# Altium schematic sheet Main_Board.SchDoc
size A0; Organization: Altium Limited; Address1: L3, 12a Rodborough Rd; Address2: Frenchs Forest; Address3: NSW; Address4: Australia 2086
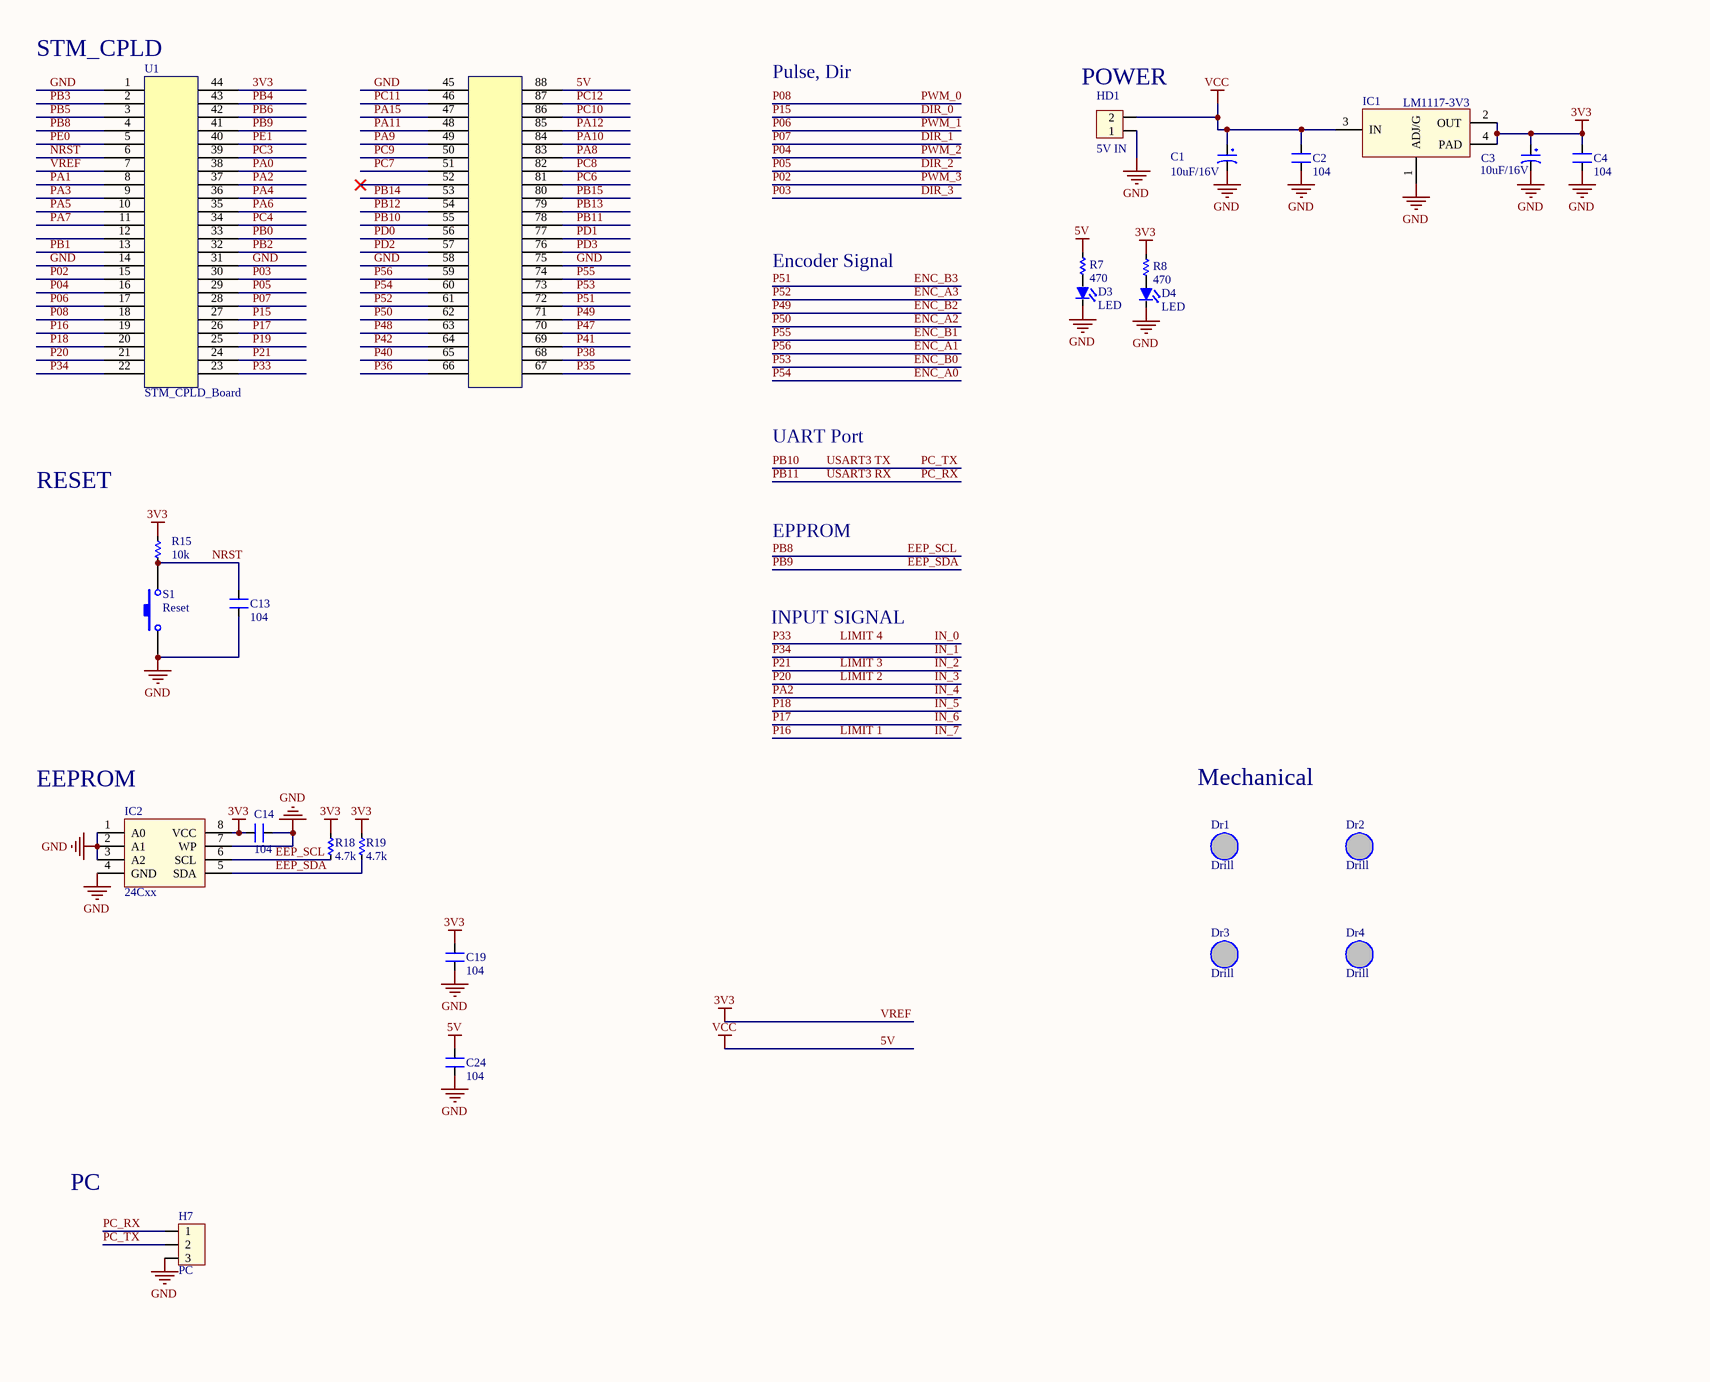
[diagram p0: Main_Board.SchDoc, top left]
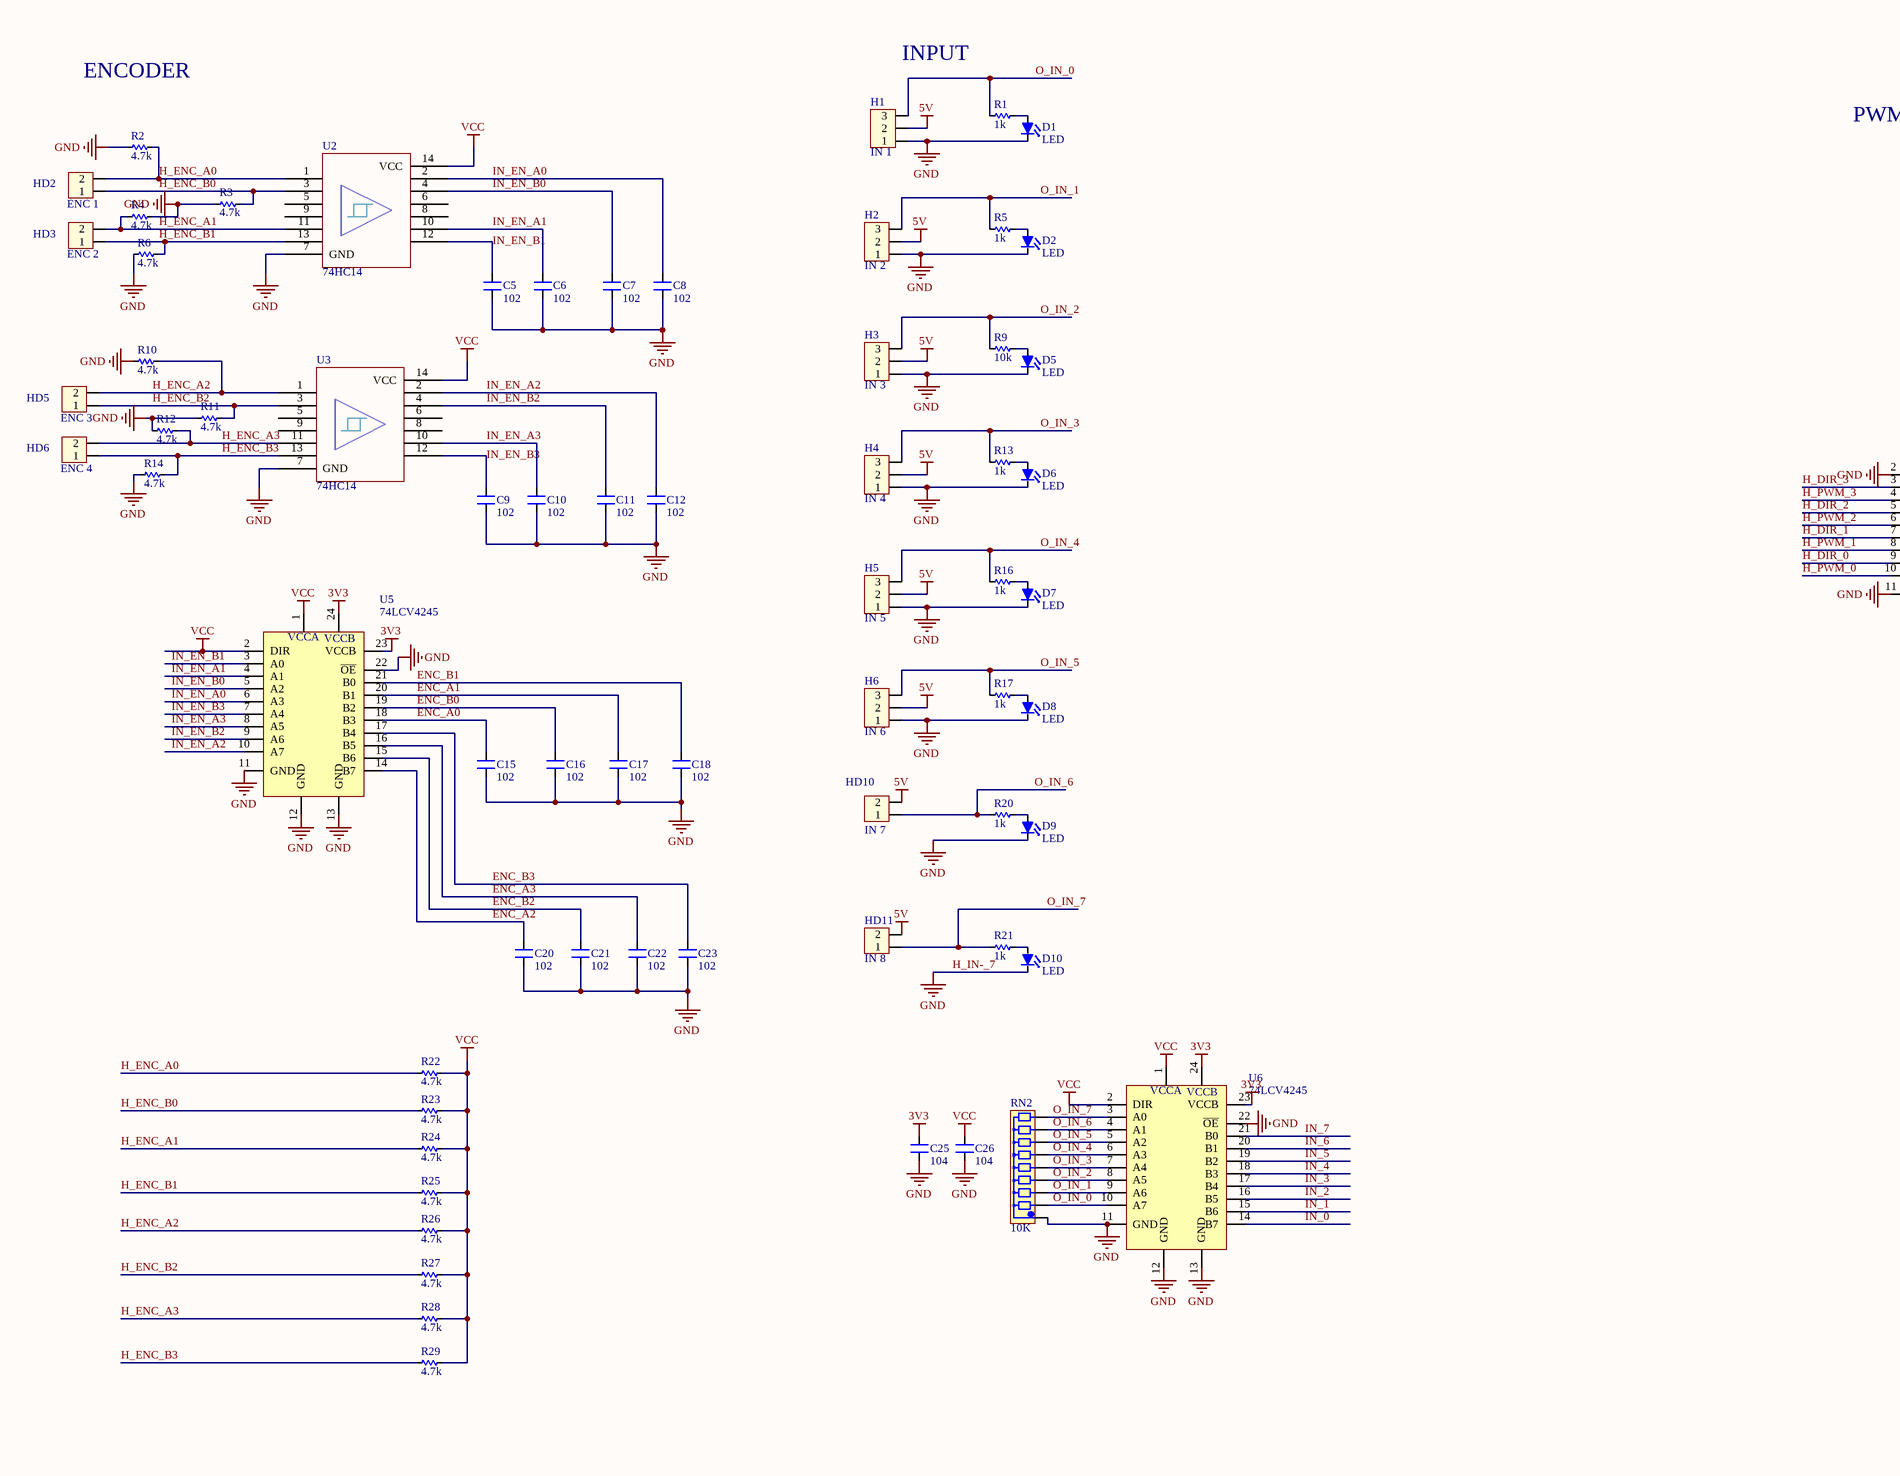
[diagram p1: Main_Board.SchDoc, top middle]
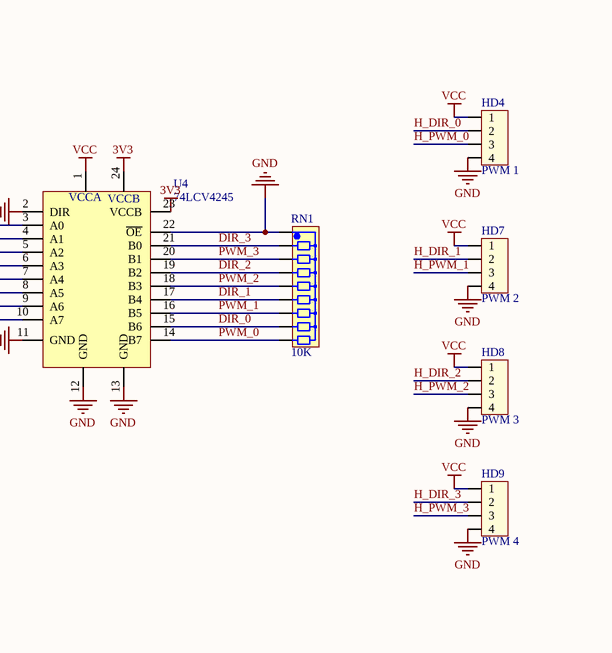
[diagram p2: Main_Board.SchDoc, top right]
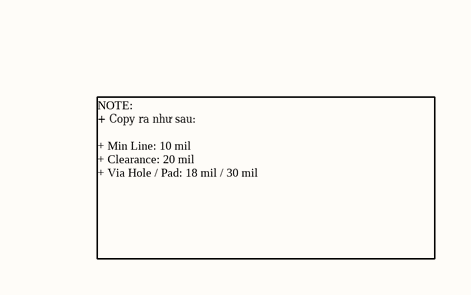
[diagram p3: Main_Board.SchDoc, bottom right]

## Parts
C1  10uF/16V  [CAP_ALU_B]
C2  104  [CAP-SM-0805]
C3  10uF/16V  [CAP_ALU_B]
C4  104  [CAP-SM-0805]
C5  102  [CAP-SM-0805]
C6  102  [CAP-SM-0805]
C7  102  [CAP-SM-0805]
C8  102  [CAP-SM-0805]
C9  102  [CAP-SM-0805]
C10  102  [CAP-SM-0805]
C11  102  [CAP-SM-0805]
C12  102  [CAP-SM-0805]
C13  104  [CAP-SM-0805]
C14  104  [CAP-SM-0805]
C15  102  [CAP-SM-0805]
C16  102  [CAP-SM-0805]
C17  102  [CAP-SM-0805]
C18  102  [CAP-SM-0805]
C19  104  [CAP-SM-0805]
C20  102  [CAP-SM-0805]
C21  102  [CAP-SM-0805]
C22  102  [CAP-SM-0805]
C23  102  [CAP-SM-0805]
C24  104  [CAP-SM-0805]
C25  104  [CAP-SM-0805]
C26  104  [CAP-SM-0805]
D1  LED  [LED_0805_Blue]
D2  LED  [LED_0805_Blue]
D3  LED  [LED_0805_Blue]
D4  LED  [LED_0805_Blue]
D5  LED  [LED_0805_Blue]
D6  LED  [LED_0805_Blue]
D7  LED  [LED_0805_Blue]
D8  LED  [LED_0805_Blue]
D9  LED  [LED_0805_Blue]
D10  LED  [LED_0805_Blue]
Dr1  Drill  [Drill 3mm]
Dr2  Drill  [Drill 3mm]
Dr3  Drill  [Drill 3mm]
Dr4  Drill  [Drill 3mm]
H1  IN 1  [Header White 3]
H2  IN 2  [Header White 3]
H3  IN 3  [Header White 3]
H4  IN 4  [Header White 3]
H5  IN 5  [Header White 3]
H6  IN 6  [Header White 3]
H7  PC  [Header White 3]
HD1  5V IN  [Domino 2]
HD2  ENC 1  [Domino 2]
HD3  ENC 2  [Domino 2]
HD4  PWM 1  [Domino 4]
HD5  ENC 3  [Domino 2]
HD6  ENC 4  [Domino 2]
HD7  PWM 2  [Domino 4]
HD8  PWM 3  [Domino 4]
HD9  PWM 4  [Domino 4]
HD10  IN 7  [Domino 2]
HD11  IN 8  [Domino 2]
IC1  LM1117-3V3  [SOT223-4N]
IC2  24Cxx  [SOIC8]
R1  1k  [RES-SM-0805]
R2  4.7k  [RES-SM-0805]
R3  4.7k  [RES-SM-0805]
R4  4.7k  [RES-SM-0805]
R5  1k  [RES-SM-0805]
R6  4.7k  [RES-SM-0805]
R7  470  [RES-SM-0805]
R8  470  [RES-SM-0805]
R9  10k  [RES-SM-0805]
R10  4.7k  [RES-SM-0805]
R11  4.7k  [RES-SM-0805]
R12  4.7k  [RES-SM-0805]
R13  1k  [RES-SM-0805]
R14  4.7k  [RES-SM-0805]
R15  10k  [RES-SM-0805]
R16  1k  [RES-SM-0805]
R17  1k  [RES-SM-0805]
R18  4.7k  [RES-SM-0805]
R19  4.7k  [RES-SM-0805]
R20  1k  [RES-SM-0805]
R21  1k  [RES-SM-0805]
R22  4.7k  [RES-SM-0805]
R23  4.7k  [RES-SM-0805]
R24  4.7k  [RES-SM-0805]
R25  4.7k  [RES-SM-0805]
R26  4.7k  [RES-SM-0805]
R27  4.7k  [RES-SM-0805]
R28  4.7k  [RES-SM-0805]
R29  4.7k  [RES-SM-0805]
RN1  10K  [RN8]
RN2  10K  [RN8]
S1  Reset  [SW2]
U1  STM_CPLD_Board  [STM_CPLD_Board]
U2  74HC14  [SO14-150mil]
U3  74HC14  [SO14-150mil]
U4  74LCV4245  [SOIC24 - wide]
U5  74LCV4245  [SOIC24 - wide]
U6  74LCV4245  [SOIC24 - wide]

## Nets
3V3: C3.1 C4.1 C14.2 C19.1 C25.2 IC1.2(OUT) IC1.4(PAD) IC2.8(VCC) R8.1 R15.1 R18.2 R19.1 U1.7 U1.44 U4.23(VCCB) U4.24(VCC(B)) U5.23(VCCB) U5.24(VCC(B)) U6.23(VCCB) U6.24(VCC(B))  [also labelled VREF]
5V: C1.1 C2.1 C24.1 C26.2 H1.2 H2.2 H3.2 H4.2 H5.2 H6.2 HD1.2 HD4.1 HD7.1 HD8.1 HD9.1 HD10.2 HD11.2 IC1.3(IN) R7.1 R22.2 R23.2 R24.2 R25.2 R26.2 R27.2 R28.2 R29.2 U1.88 U2.14(VCC) U3.14(VCC) U4.1(VCC(A)) U5.1(VCC(A)) U5.2(DIR) U6.1(VCC(A)) U6.2(DIR)  [also labelled VCC]
GND: C1.2 C2.2 C3.2 C4.2 C5.1 C6.1 C7.1 C8.1 C9.1 C10.1 C11.1 C12.1 C13.2 C14.1 C15.1 C16.1 C17.1 C18.1 C19.2 C20.1 C21.1 C22.1 C23.1 C24.2 C25.1 C26.1 D1.2(K) D2.2(K) D3.2(K) D4.2(K) D5.2(K) D6.2(K) D7.2(K) D8.2(K) D9.2(K) D10.2(K) H1.1 H2.1 H3.1 H4.1 H5.1 H6.1 H7.3 HD1.1 HD4.4 HD7.4 HD8.4 HD9.4 IC1.1(ADJ/G) IC2.1(A0) IC2.2(A1) IC2.3(A2) IC2.4(GND) IC2.7(WP) R2.2 R3.2 R4.1 R6.2 R10.2 R11.2 R12.2 R14.2 RN1.1 RN2.1 S1.1 U1.1 U1.14 U1.31 U1.45 U1.58 U1.75 U2.7(GND) U3.7(GND) U4.2(DIR) U4.11(GND) U4.12(GND) U4.13(GND) U4.22(~{OE}) U5.11(GND) U5.12(GND) U5.13(GND) U5.22(~{OE}) U6.11(GND) U6.12(GND) U6.13(GND) U6.22(~{OE})  [also labelled H_IN-_7]
DIR_0: RN1.8 U1.27 U4.15(B6)  [also labelled P15]
DIR_1: RN1.6 U1.28 U4.17(B4)  [also labelled P07]
DIR_2: RN1.4 U1.29 U4.19(B2)  [also labelled P05]
DIR_3: RN1.2 U1.30 U4.21(B0)  [also labelled P03]
EEP_SCL: IC2.6(SCL) R18.1 U1.4  [also labelled PB8]
EEP_SDA: IC2.5(SDA) R19.2 U1.41  [also labelled PB9]
ENC_A0: C15.2 U1.60 U5.18(B3)  [also labelled P54]
ENC_A1: C17.2 U1.59 U5.20(B1)  [also labelled P56]
ENC_A2: C20.2 U1.62 U5.14(B7)  [also labelled P50]
ENC_A3: C22.2 U1.61 U5.16(B5)  [also labelled P52]
ENC_B0: C16.2 U1.73 U5.19(B2)  [also labelled P53]
ENC_B1: C18.2 U1.74 U5.21(B0)  [also labelled P55]
ENC_B2: C21.2 U1.71 U5.15(B6)  [also labelled P49]
ENC_B3: C23.2 U1.72 U5.17(B4)  [also labelled P51]
H_DIR_0: HD4.2 U4.9(A6)
H_DIR_1: HD7.2 U4.7(A4)
H_DIR_2: HD8.2 U4.5(A2)
H_DIR_3: HD9.2 U4.3(A0)
H_ENC_A0: HD2.2 R2.1 R22.1 U2.1
H_ENC_A1: HD3.2 R4.2 R24.1 U2.11
H_ENC_A2: HD5.2 R10.1 R26.1 U3.1
H_ENC_A3: HD6.2 R12.1 R28.1 U3.11
H_ENC_B0: HD2.1 R3.1 R23.1 U2.3
H_ENC_B1: HD3.1 R6.1 R25.1 U2.13
H_ENC_B2: HD5.1 R11.1 R27.1 U3.3
H_ENC_B3: HD6.1 R14.1 R29.1 U3.13
H_PWM_0: HD4.3 U4.10(A7)
H_PWM_1: HD7.3 U4.8(A5)
H_PWM_2: HD8.3 U4.6(A3)
H_PWM_3: HD9.3 U4.4(A1)
IN_0: U1.23 U6.14(B7)  [also labelled LIMIT 4, P33]
IN_1: U1.22 U6.15(B6)  [also labelled P34]
IN_2: U1.24 U6.16(B5)  [also labelled LIMIT 3, P21]
IN_3: U1.21 U6.17(B4)  [also labelled LIMIT 2, P20]
IN_4: U1.37 U6.18(B3)  [also labelled PA2]
IN_5: U1.20 U6.19(B2)  [also labelled P18]
IN_6: U1.26 U6.20(B1)  [also labelled P17]
IN_7: U1.19 U6.21(B0)  [also labelled LIMIT 1, P16]
IN_EN_A0: C8.2 U2.2 U5.6(A3)
IN_EN_A1: C6.2 U2.10 U5.4(A1)
IN_EN_A2: C12.2 U3.2 U5.10(A7)
IN_EN_A3: C10.2 U3.10 U5.8(A5)
IN_EN_B0: C7.2 U2.4 U5.5(A2)
IN_EN_B1: C5.2 U2.12 U5.3(A0)
IN_EN_B2: C11.2 U3.4 U5.9(A6)
IN_EN_B3: C9.2 U3.12 U5.7(A4)
NRST: C13.1 R15.2 S1.2 U1.6
O_IN_0: H1.3 R1.2 RN2.2 U6.10(A7)
O_IN_1: H2.3 R5.2 RN2.3 U6.9(A6)
O_IN_2: H3.3 R9.2 RN2.4 U6.8(A5)
O_IN_3: H4.3 R13.2 RN2.5 U6.7(A4)
O_IN_4: H5.3 R16.2 RN2.6 U6.6(A3)
O_IN_5: H6.3 R17.2 RN2.7 U6.5(A2)
O_IN_6: HD10.1 R20.2 RN2.8 U6.4(A1)
O_IN_7: HD11.1 R21.2 RN2.9 U6.3(A0)
P02: RN1.3 U1.15 U4.20(B1)  [also labelled PWM_3]
P04: RN1.5 U1.16 U4.18(B3)  [also labelled PWM_2]
P06: RN1.7 U1.17 U4.16(B5)  [also labelled PWM_1]
P08: RN1.9 U1.18 U4.14(B7)  [also labelled PWM_0]
P19: U1.25
P35: U1.67
P36: U1.66
P38: U1.68
P40: U1.65
P41: U1.69
P42: U1.64
P47: U1.70
P48: U1.63
PA0: U1.38
PA1: U1.8
PA3: U1.9
PA4: U1.36
PA5: U1.10
PA6: U1.35
PA7: U1.11
PA8: U1.83
PA9: U1.49
PA10: U1.84
PA11: U1.48
PA12: U1.85
PA15: U1.47
PB0: U1.33
PB1: U1.13
PB2: U1.32
PB3: U1.2
PB4: U1.43
PB5: U1.3
PB6: U1.42
PB10: H7.2 U1.55  [also labelled PC_TX, USART3 TX]
PB11: H7.1 U1.78  [also labelled PC_RX, USART3 RX]
PB12: U1.54
PB13: U1.79
PB14: U1.53
PB15: U1.80
PC3: U1.39
PC4: U1.34
PC6: U1.81
PC7: U1.51
PC8: U1.82
PC9: U1.50
PC10: U1.86
PC11: U1.46
PC12: U1.87
PD0: U1.56
PD1: U1.77
PD2: U1.57
PD3: U1.76
PE0: U1.5
PE1: U1.40
NetD1_1: D1.1(A) R1.1
NetD2_1: D2.1(A) R5.1
NetD3_1: D3.1(A) R7.2
NetD4_1: D4.1(A) R8.2
NetD5_1: D5.1(A) R9.1
NetD6_1: D6.1(A) R13.1
NetD7_1: D7.1(A) R16.1
NetD8_1: D8.1(A) R17.1
NetD9_1: D9.1(A) R20.1
NetD10_1: D10.1(A) R21.1

Not connected (* = marked no-connect by the designer): U1 12 52*; U2 5 6 8(7) 9(8); U3 5 6 8(7) 9(8)

## Notes on the sheet
- (near U1) STM_CPLD
- INPUT
- Pulse, Dir
- (near HD1) POWER
- ENCODER
- PWM
- Encoder Signal
- UART Port
- RESET
- EPPROM
- INPUT SIGNAL
- (near IC2) EEPROM
- Mechanical
- PC
- NOTE:
  + Copy ra như sau:
  + Min Line: 10 mil
  + Clearance: 20 mil
  + Via Hole / Pad: 18 mil / 30 mil
- Title
- Size:
- Date:
- File:
- A0
- Number:
- Time:
- Revision:
- Sheet
- of
- (in symbol 74LCV4245) VCCA

## Library data of the parts
C1 C3 = CP2: C 47uF/50V , 220uF/16V; Value: 47uF/16 - 50V; Description 1: 470uF/6,3V - 330uF/10V - 220uF/16V; Description 2: 100uF/25V - 35V - 47uF/50V - 22uF/100V; Description 3: 33uF => 47uF/63V - 1uF => 4,7uF/160V; Description 4: 1uF => 2,2uF/250V - 1uF/350V
C2 C4-C26 = CAP_SM_0805: Ceramic Capacitor SMD
D1-D10 = LED_SMD: LED SMD
Dr1-Dr4 = Drill 3mm
H1-H7 = Header white 3: Connector 3; Value: Connector 3
HD1-HD3 HD5 HD6 HD10 HD11 = Domino 2: Domino 2 200mil; Value: Domino 2
HD4 HD7-HD9 = Domino 4: Domino 4 200mil; Value: Domino 4
IC1 = LM1117: Available in 1.8V, 2.5V, 2.85V, 3.3V, 5V, and  Adjustable Versions; Value: LM317
IC2 = 24Cxx: Standard 2-Wire Bus Interface Serial EEPROM; Value: DIP 8; Copyright by: VanDungEvn
R1-R29 = Res-SMD: Resistor; Manufacturer: Generic Components; Class: Passive; Published: 08/06/2000; Publisher: Altium Hobart Technology Centre
RN1 RN2 = RN8: Resistor 8 (Thanh); Value: Tro thanh 10K
S1 = SW - 2Pin: Switch button 2 pin
U1 = STM_CPLD_Board: STM32f4 and Max2 570 on one board
U2 U3 = 74HC14: Hex Inverters With SCHMITT-TRIGGER Inputs
U4-U6 = 74LCV4245: Octal dual supply translating transceiver; 3-state